# Altium schematic sheet Mosfet_and_Driver.SchDoc
size A4; Date: 22.07.2025; CheckedBy: Own Checked; CompanyName: No Company; DocumentNumber: ELK.PCB.0001.0001.A.A; Revision: V0.0.1; SheetNumber: 5; SheetTotal: 5
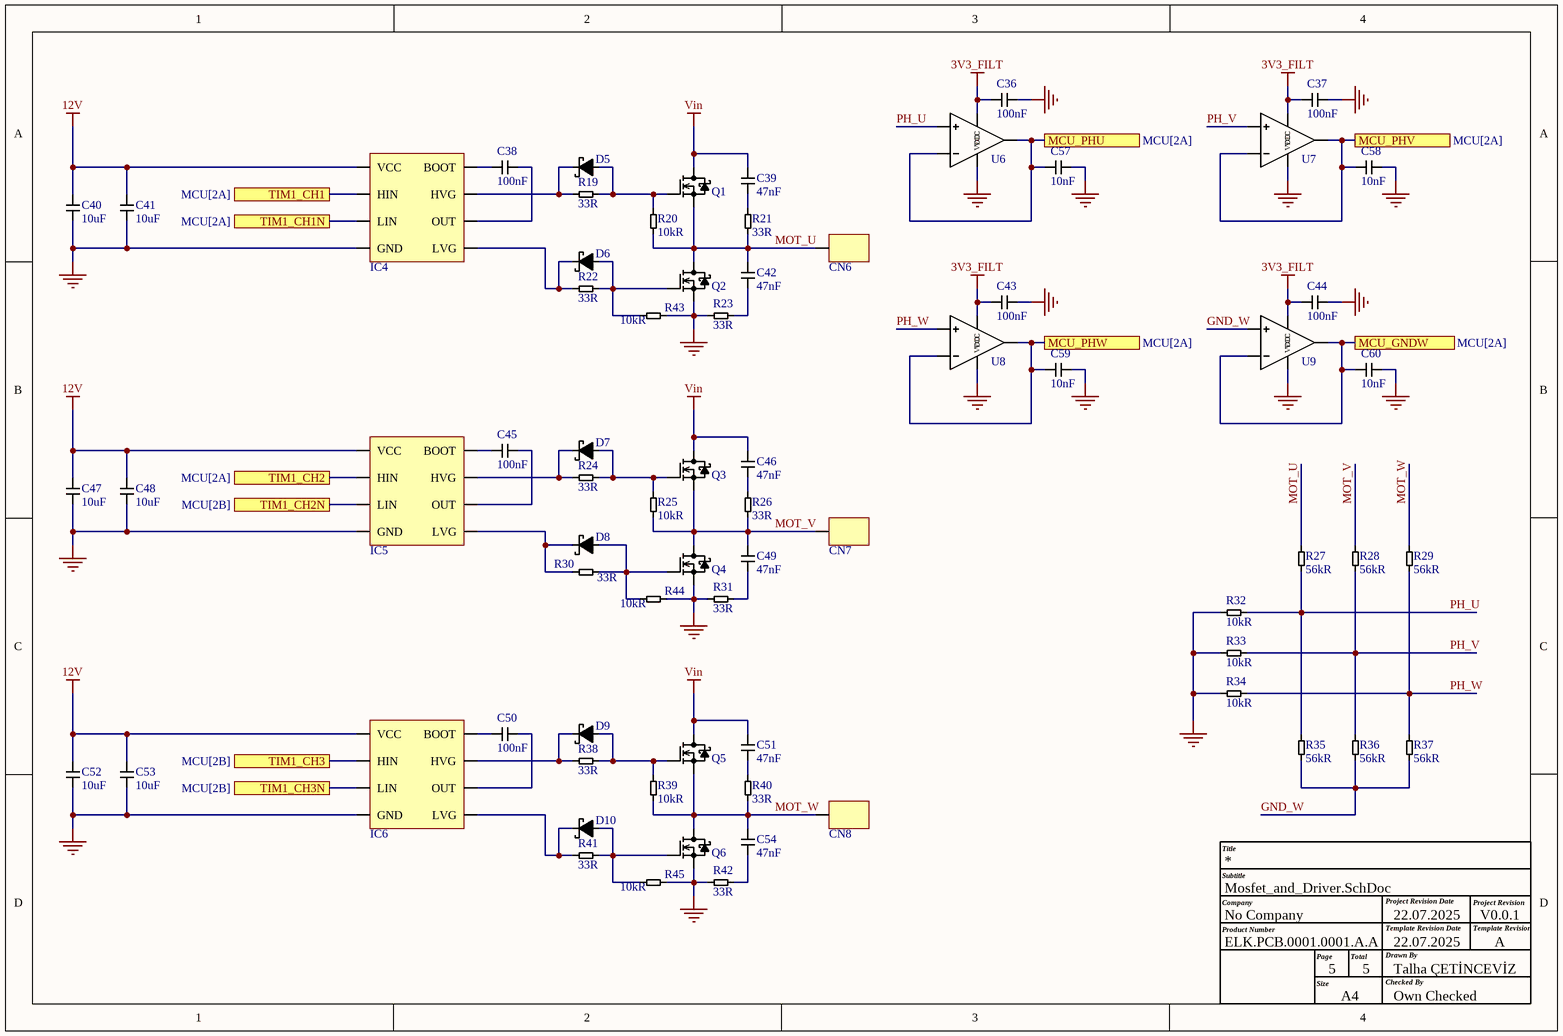
[diagram p0: Mosfet_and_Driver.SchDoc]

## Parts
C36  value 100nF  [CAP 0603]  (hidden comment: CC0603KRX7R9BB104)
C37  value 100nF  [CAP 0603]  (hidden comment: CC0603KRX7R9BB104)
C38  value 100nF  [CAP 0805]  (hidden comment: CL21B104KBCNNNC)
C39  value 47nF  [CAP 1206]  (hidden comment: CL31B473KBCNNNC)
C40  value 10uF  [CAP 0805]  (hidden comment: CL21A106KAYNNNE)
C41  value 10uF  [CAP 0805]  (hidden comment: CL21A106KAYNNNE)
C42  value 47nF  [CAP 1206]  (hidden comment: CL31B473KBCNNNC)
C43  value 100nF  [CAP 0603]  (hidden comment: CC0603KRX7R9BB104)
C44  value 100nF  [CAP 0603]  (hidden comment: CC0603KRX7R9BB104)
C45  value 100nF  [CAP 0805]  (hidden comment: CL21B104KBCNNNC)
C46  value 47nF  [CAP 1206]  (hidden comment: CL31B473KBCNNNC)
C47  value 10uF  [CAP 0805]  (hidden comment: CL21A106KAYNNNE)
C48  value 10uF  [CAP 0805]  (hidden comment: CL21A106KAYNNNE)
C49  value 47nF  [CAP 1206]  (hidden comment: CL31B473KBCNNNC)
C50  value 100nF  [CAP 0805]  (hidden comment: CL21B104KBCNNNC)
C51  value 47nF  [CAP 1206]  (hidden comment: CL31B473KBCNNNC)
C52  value 10uF  [CAP 0805]  (hidden comment: CL21A106KAYNNNE)
C53  value 10uF  [CAP 0805]  (hidden comment: CL21A106KAYNNNE)
C54  value 47nF  [CAP 1206]  (hidden comment: CL31B473KBCNNNC)
C57  value 10nF  [CAP 0603]  (hidden comment: CL10B103KB8NNNC)
C58  value 10nF  [CAP 0603]  (hidden comment: CL10B103KB8NNNC)
C59  value 10nF  [CAP 0603]  (hidden comment: CL10B103KB8NNNC)
C60  value 10nF  [CAP 0603]  (hidden comment: CL10B103KB8NNNC)
CN6  SMD PAD 1  [SMD PAD 1]  (value not drawn)  (no BOM)
CN7  SMD PAD 1  [SMD PAD 1]  (value not drawn)  (no BOM)
CN8  SMD PAD 1  [SMD PAD 1]  (value not drawn)  (no BOM)
D5  SS2060FL_R1_00001  [SOD123-FL]  (value not drawn)
D6  SS2060FL_R1_00001  [SOD123-FL]  (value not drawn)
D7  SS2060FL_R1_00001  [SOD123-FL]  (value not drawn)
D8  SS2060FL_R1_00001  [SOD123-FL]  (value not drawn)
D9  SS2060FL_R1_00001  [SOD123-FL]  (value not drawn)
D10  SS2060FL_R1_00001  [SOD123-FL]  (value not drawn)
IC4  L6388ED013TR  [SOIC-8]  (value not drawn)
IC5  L6388ED013TR  [SOIC-8]  (value not drawn)
IC6  L6388ED013TR  [SOIC-8]  (value not drawn)
Q1  P80FH5ENK-7071  [D2PAK-3]  (value not drawn)
Q2  P80FH5ENK-7071  [D2PAK-3]  (value not drawn)
Q3  P80FH5ENK-7071  [D2PAK-3]  (value not drawn)
Q4  P80FH5ENK-7071  [D2PAK-3]  (value not drawn)
Q5  P80FH5ENK-7071  [D2PAK-3]  (value not drawn)
Q6  P80FH5ENK-7071  [D2PAK-3]  (value not drawn)
R19  value 33R  [RES 0805]  (hidden comment: 0805S8F330JT5E)
R20  value 10kR  [RES 0603]  (hidden comment: RC0603FR-0710KL)
R21  value 33R  [RES 1206]  (hidden comment: CQ06S4F330JT5E)
R22  value 33R  [RES 0805]  (hidden comment: 0805S8F330JT5E)
R23  value 33R  [RES 1206]  (hidden comment: CQ06S4F330JT5E)
R24  value 33R  [RES 0805]  (hidden comment: 0805S8F330JT5E)
R25  value 10kR  [RES 0603]  (hidden comment: RC0603FR-0710KL)
R26  value 33R  [RES 1206]  (hidden comment: CQ06S4F330JT5E)
R27  value 56kR  [RES 0603]  (hidden comment: 0603SAF5602T5E)
R28  value 56kR  [RES 0603]  (hidden comment: 0603SAF5602T5E)
R29  value 56kR  [RES 0603]  (hidden comment: 0603SAF5602T5E)
R30  value 33R  [RES 0805]  (hidden comment: 0805S8F330JT5E)
R31  value 33R  [RES 1206]  (hidden comment: CQ06S4F330JT5E)
R32  value 10kR  [RES 0603]  (hidden comment: RC0603FR-0710KL)
R33  value 10kR  [RES 0603]  (hidden comment: RC0603FR-0710KL)
R34  value 10kR  [RES 0603]  (hidden comment: RC0603FR-0710KL)
R35  value 56kR  [RES 0603]  (hidden comment: 0603SAF5602T5E)
R36  value 56kR  [RES 0603]  (hidden comment: 0603SAF5602T5E)
R37  value 56kR  [RES 0603]  (hidden comment: 0603SAF5602T5E)
R38  value 33R  [RES 0805]  (hidden comment: 0805S8F330JT5E)
R39  value 10kR  [RES 0603]  (hidden comment: RC0603FR-0710KL)
R40  value 33R  [RES 1206]  (hidden comment: CQ06S4F330JT5E)
R41  value 33R  [RES 0805]  (hidden comment: 0805S8F330JT5E)
R42  value 33R  [RES 1206]  (hidden comment: CQ06S4F330JT5E)
R43  value 10kR  [RES 0603]  (hidden comment: RC0603FR-0710KL)
R44  value 10kR  [RES 0603]  (hidden comment: RC0603FR-0710KL)
R45  value 10kR  [RES 0603]  (hidden comment: RC0603FR-0710KL)
U6  LMV321ILT  [SOT23-5]  (value not drawn)
U7  LMV321ILT  [SOT23-5]  (value not drawn)
U8  LMV321ILT  [SOT23-5]  (value not drawn)
U9  LMV321ILT  [SOT23-5]  (value not drawn)

## Ports
MCU_GNDW (see MCU[2A]), MCU_PHU (see MCU[2A]), MCU_PHV (see MCU[2A]), MCU_PHW (see MCU[2A]), TIM1_CH1 (see MCU[2A]), TIM1_CH1N (see MCU[2A]), TIM1_CH2 (see MCU[2A]), TIM1_CH2N (see MCU[2B]), TIM1_CH3 (see MCU[2B]), TIM1_CH3N (see MCU[2B])

## Nets
3V3_FILT: C36.1 C37.1 C43.1 C44.1 U6.5(VCC) U7.5(VCC) U8.5(VCC) U9.5(VCC)
12V: C40.2 C41.2 C47.2 C48.2 C52.2 C53.2 IC4.3(VCC) IC5.3(VCC) IC6.3(VCC)
GND: C36.2 C37.2 C40.1 C41.1 C43.2 C44.2 C47.1 C48.1 C52.1 C53.1 C57.2 C58.2 C59.2 C60.2 IC4.4(GND) IC5.4(GND) IC6.4(GND) Q2.3(Source) Q4.3(Source) Q6.3(Source) R23.2 R31.2 R32.2 R33.2 R34.2 R42.2 R43.2 R44.2 R45.2 U6.2(VDD) U7.2(VDD) U8.2(VDD) U9.2(VDD)
Vin: C39.2 C46.2 C51.2 Q1.2(Drain) Q3.2(Drain) Q5.2(Drain)
GND_W: R35.1 R36.1 R37.1 U9.1(NON_Inverting_input)
MCU_GNDW: C60.1 U9.3(Inverting_Input) U9.4(Output) ; port MCU_GNDW
MCU_PHU: C57.1 U6.3(Inverting_Input) U6.4(Output) ; port MCU_PHU
MCU_PHV: C58.1 U7.3(Inverting_Input) U7.4(Output) ; port MCU_PHV
MCU_PHW: C59.1 U8.3(Inverting_Input) U8.4(Output) ; port MCU_PHW
MOT_U: C42.2 CN6.1 Q1.3(Source) Q2.2(Drain) R20.1 R21.1 R27.2
MOT_V: C49.2 CN7.1 Q3.3(Source) Q4.2(Drain) R25.1 R26.1 R28.2
MOT_W: C54.2 CN8.1 Q5.3(Source) Q6.2(Drain) R29.2 R39.1 R40.1
PH_U: R27.1 R32.1 R35.2 U6.1(NON_Inverting_input)
PH_V: R28.1 R33.1 R36.2 U7.1(NON_Inverting_input)
PH_W: R29.1 R34.1 R37.2 U8.1(NON_Inverting_input)
TIM1_CH1: IC4.2(HIN) ; port TIM1_CH1
TIM1_CH1N: IC4.1(LIN) ; port TIM1_CH1N
TIM1_CH2: IC5.2(HIN) ; port TIM1_CH2
TIM1_CH2N: IC5.1(LIN) ; port TIM1_CH2N
TIM1_CH3: IC6.2(HIN) ; port TIM1_CH3
TIM1_CH3N: IC6.1(LIN) ; port TIM1_CH3N
NetC38_1: C38.1 IC4.8(BOOT)
NetC38_2: C38.2 IC4.6(OUT)
NetC39_1: C39.1 R21.2
NetC42_1: C42.1 R23.1
NetC45_1: C45.1 IC5.8(BOOT)
NetC45_2: C45.2 IC5.6(OUT)
NetC46_1: C46.1 R26.2
NetC49_1: C49.1 R31.1
NetC50_1: C50.1 IC6.8(BOOT)
NetC50_2: C50.2 IC6.6(OUT)
NetC51_1: C51.1 R40.2
NetC54_1: C54.1 R42.1
NetD5_A: D5.A Q1.1(Gate) R19.2 R20.2
NetD5_C: D5.C IC4.7(HVG) R19.1
NetD6_A: D6.A Q2.1(Gate) R22.2 R43.1
NetD6_C: D6.C IC4.5(LVG) R22.1
NetD7_A: D7.A Q3.1(Gate) R24.2 R25.2
NetD7_C: D7.C IC5.7(HVG) R24.1
NetD8_A: D8.A Q4.1(Gate) R30.2 R44.1
NetD8_C: D8.C IC5.5(LVG) R30.1
NetD9_A: D9.A Q5.1(Gate) R38.2 R39.2
NetD9_C: D9.C IC6.7(HVG) R38.1
NetD10_A: D10.A Q6.1(Gate) R41.2 R45.1
NetD10_C: D10.C IC6.5(LVG) R41.1

## Notes on the sheet
- Title
- Company
- Product Number
- Subtitle
- Project Revision Date
- Template Revision Date
- Project Revision
- Template Revision
- Size
- Page
- A4
- Total
- Checked By
- Drawn By
- 22.07.2025
- Talha ÇETİNCEVİZ
- A

## Library data of the parts
C36 C37 C43 C44 = CC0603KRX7R9BB104: Multilayer Ceramic Capacitor, CC Series, 0.1 - F, - 10%, X7R, 50 V, 0603 [1608 Metric]; Manufacturer: Yageo; Dielectric Material: 4241ConductorMaterial; Voltage Rating: 50V; Supplier: Ozdisan; Supplier Part Number: CC0603KRX7R9BB104; Manufacturer Part Number: CC0603KRX7R9BB104; RoHS: Yes; Category: Ceramic Capacitors; Stock: 5600000; Pricing: 4000=0,0018, 20000=0,0017, 80000=0,0017, 200000=0,0016, 500000=0,0015 (USD); Mounting Technology: Surface Mount; Case/Package: 0603; Pins: 2; Case Code (Metric): 1608; Case Code (Imperial): 0603; Material: 4241ConductorMaterial; Min Operating Temperature: -55°C; Max Operating Temperature: 125°C; Tolerance: 10%; Dielectric: X7R; Termination: SMD/SMT; Voltage: 50V; Package Quantity: 1; Packaging: Tape and Reel; Series: CC; Length: 0.063inch; Width: 0.031inch; Height: 0.8mm; Thickness: 0.035inch; Depth: 0.8mm; Radiation Hardening: No; Reach SVHC Compliant: No; Lead Free: 5697LeadFree; Halogen Free: 5694HalogenFree; RoHS Compliant: Yes; ComponentLink1URL: https://datasheet.ciiva.com/11786/0900766b80d84f1d-11786061.pdf?src-supplier=Rs; ComponentLink1Description: https://datasheet.ciiva.com/11786/0900766b80d84f1d-11786061.pdf?src-supplier=Rs; ComponentLink2URL: https://datasheet.ciiva.com/8033/70765-8033821.pdf?src-supplier=Element14; ComponentLink2Description: https://datasheet.ciiva.com/8033/70765-8033821.pdf?src-supplier=Element14; ComponentLink3URL: https://datasheet.ciiva.com/7978/1489800-7978166.pdf?src-supplier=Element14; ComponentLink3Description: https://datasheet.ciiva.com/7978/1489800-7978166.pdf?src-supplier=Element14; ComponentLink4URL: https://datasheet.ciiva.com/144/mlccorderingcode-144177.pdf?src-supplier=Digikey; ComponentLink4Description: https://datasheet.ciiva.com/144/mlccorderingcode-144177.pdf?src-supplier=Digikey; ComponentLink5URL: https://datasheet.ciiva.com/144/mlccorderingcode-144176.pdf?src-supplier=Digikey; ComponentLink5Description: https://datasheet.ciiva.com/144/mlccorderingcode-144176.pdf?src-supplier=Digikey; ComponentLink6URL: https://datasheet.ciiva.com/144/mlccorderingcode-144178.pdf?src-supplier=Digikey; ComponentLink6Description: https://datasheet.ciiva.com/144/mlccorderingcode-144178.pdf?src-supplier=Digikey; ComponentLink7URL: https://datasheet.ciiva.com/8033/70765-8033819.pdf?src-supplier=Element14; ComponentLink7Description: https://datasheet.ciiva.com/8033/70765-8033819.pdf?src-supplier=Element14; ComponentLink8URL: https://datasheet.ciiva.com/31394/1489800-31394927.pdf?src-supplier=Farnell; ComponentLink8Description: https://datasheet.ciiva.com/31394/1489800-31394927.pdf?src-supplier=Farnell; ComponentLink9URL: https://datasheet.ciiva.com/22749/1489800-22749214.pdf?src-supplier=Element14; ComponentLink9Description: https://datasheet.ciiva.com/22749/1489800-22749214.pdf?src-supplier=Element14
C38 C45 C50 = CL21B104KBCNNNC: 50V 100nF X7R ±10% 0805 Multilayer Ceramic Capacitors MLCC - SMD/SMT ROHS; Manufacturer: Samsung; Supplier: Ozdisan; Supplier Part Number: CL21B104KBCNNNC; Manufacturer Part Number: CL21B104KBCNNNC; RoHS: Yes; Category: Ceramic Capacitors; Stock: 648000; Pricing: 4000=0,00539, 8000=0,00525, 16000=0,00508, 24000=0,0049, 32000=0,00473 (USD); Mounting Technology: Surface Mount; Case/Package: 0805; Case Code (Metric): 2012; Case Code (Imperial): 0805; Material: Ceramic; Min Operating Temperature: -55°C; Max Operating Temperature: 125°C; Tolerance: 10%; Dielectric: X7R; Packaging: Tape and Reel; Voltage Rating: 50V; Voltage: 50V; Series: CL; Construction: Flat; Voltage Rating (DC): 50V; Length: 2mm; Width: 0.049inch; Height: 0.85mm; Depth: 1.25mm; Thickness: 0.037inch; Radiation Hardening: No; RoHS Compliant: Yes; Lead Free: 5697LeadFree; ComponentLink1URL: https://datasheet.ciiva.com/25710/cl21b104kbcnnnc-25710182.pdf?src-supplier=Digikey; ComponentLink1Description: https://datasheet.ciiva.com/25710/cl21b104kbcnnnc-25710182.pdf?src-supplier=Digikey; ComponentLink2URL: https://datasheet.ciiva.com/29199/454152-da-01-en-vs-kondensator-0805-29199814.pdf?src-supplier=Conrad; ComponentLink2Description: https://datasheet.ciiva.com/29199/454152-da-01-en-vs-kondensator-0805-29199814.pdf?src-supplier=Conrad
C39 C42 C46 C49 C51 C54 = CL31B473KBCNNNC: MLCC (3216) 1206 47nF 50VDC ±10% X7R; Manufacturer: Samsung; Material: Ceramic; Tolerance: %10; Voltage Rating (DC): 50V; Supplier: Ozdisan; Supplier Part Number: CL31B473KBCNNNC; Manufacturer Part Number: CL31B473KBCNNNC; RoHS: Yes; Category: Ceramic Capacitors; Stock: 308000; Pricing: 16000=0,0114 (USD); ComponentLink1URL: https://datasheet.ciiva.com/15196/getdatasheetpartid-358694-15196056.pdf?src-supplier=Verical; ComponentLink1Description: https://datasheet.ciiva.com/15196/getdatasheetpartid-358694-15196056.pdf?src-supplier=Verical; ComponentLink2URL: https://datasheet.ciiva.com/29201/452141-da-01-en-vs-kondensator-1206-29201464.pdf?src-supplier=Conrad; ComponentLink2Description: https://datasheet.ciiva.com/29201/452141-da-01-en-vs-kondensator-1206-29201464.pdf?src-supplier=Conrad; ComponentLink3URL: https://datasheet.ciiva.com/16428/cl05b104kq5nnnc-16428956.pdf?src-supplier=Future+Electronics; ComponentLink3Description: https://datasheet.ciiva.com/16428/cl05b104kq5nnnc-16428956.pdf?src-supplier=Future+Electronics; Dielectric: X7R; Case/Package: 1206; Min Operating Temperature: -55°C; Max Operating Temperature: 125°C
C40 C41 C47 C48 C52 C53 = CL21A106KAYNNNE: 25V 10uF X5R ±10% 0805 Multilayer Ceramic Capacitors MLCC - SMD/SMT ROHS; Manufacturer: Samsung; Supplier: Ozdisan; Supplier Part Number: CL21A106KAYNNNE; Manufacturer Part Number: CL21A106KAYNNNE; RoHS: Yes; Category: Ceramic Capacitors; Stock: 3442000; Pricing: 2000=0,00823 (USD); Mounting Technology: Surface Mount; Case/Package: 0805; Case Code (Metric): 2012; Case Code (Imperial): 0805; Material: Ceramic; Min Operating Temperature: -55°C; Max Operating Temperature: 85°C; Package Quantity: 1; Packaging: Tape and Reel; Tolerance: 10%; Voltage Rating: 25V; Dielectric: X5R; Series: CL; Construction: Flat; Voltage Rating (DC): 25V; Length: 2mm; Width: 0.049inch; Height: 1.25mm; Thickness: 0.057inch; Depth: 1.25mm; Radiation Hardening: No; RoHS Compliant: Yes; ComponentLink1URL: https://datasheet.ciiva.com/25796/cl21a106kaynnne-25796720.pdf?src-supplier=Digikey; ComponentLink1Description: https://datasheet.ciiva.com/25796/cl21a106kaynnne-25796720.pdf?src-supplier=Digikey; ComponentLink2URL: https://datasheet.ciiva.com/26838/getdatasheetpartid-357558-26838583.pdf?src-supplier=Verical; ComponentLink2Description: https://datasheet.ciiva.com/26838/getdatasheetpartid-357558-26838583.pdf?src-supplier=Verical
C57-C60 = CL10B103KB8NNNC: 50V 10nF X7R ±10% 0603 Multilayer Ceramic Capacitors MLCC - SMD/SMT ROHS; Manufacturer: Samsung; Supplier: Ozdisan; Supplier Part Number: CL10B103KB8NNNC; Manufacturer Part Number: CL10B103KB8NNNC; RoHS: Yes; Category: Ceramic Capacitors; Stock: 2448000; Pricing: 4000=0,00299, 8000=0,00291, 16000=0,00281, 24000=0,00272, 32000=0,00262 (USD); Mounting Technology: Surface Mount; Case/Package: 0603; Case Code (Metric): 1608; Case Code (Imperial): 0603; Material: Ceramic; Min Operating Temperature: -55°C; Max Operating Temperature: 125°C; Tolerance: 10%; Dielectric: X7R; Voltage: 50V; Voltage Rating (DC): 50V; Voltage Rating: 50V; Package Quantity: 1; Packaging: Tape and Reel; Series: CL; Construction: Flat; Length: 1.6mm; Width: 0.031inch; Height: 0.8mm; Depth: 0.8mm; Thickness: 0.035inch; Radiation Hardening: No; Lead Free: 5697LeadFree; RoHS Compliant: Yes; ComponentLink1URL: https://datasheet.ciiva.com/15195/getdatasheetpartid-357415-15195721.pdf?src-supplier=Verical; ComponentLink1Description: https://datasheet.ciiva.com/15195/getdatasheetpartid-357415-15195721.pdf?src-supplier=Verical; ComponentLink2URL: https://datasheet.ciiva.com/29198/457455-da-01-en-vs-kondensator-0603-29198644.pdf?src-supplier=Conrad; ComponentLink2Description: https://datasheet.ciiva.com/29198/457455-da-01-en-vs-kondensator-0603-29198644.pdf?src-supplier=Conrad
D5-D10 = SS2060FL_R1_00001: Schottky-diode 2A 60V SOD123FL; Manufacturer: Pan Jit; Max Reverse Current: 500uA; Peak Non-Repetitive Surge Current: 50A; Supplier: Ozdisan; Supplier Part Number: SS2060FL_R1_00001; Manufacturer Part Number: SS2060FL_R1_00001; RoHS: Yes; Category: Rectifier Diodes; Stock: 6399; Pricing: 1=0,36, 10=0,232, 50=0,232, 100=0,161, 1000=0,107, 10000=0,067 (USD); Mounting Technology: Surface Mount; Pins: 2; Min Operating Temperature: -50°C; Max Operating Temperature: 125°C; Max Repetitive Reverse Voltage (Vrrm): 60V; RoHS Compliant: Yes; ComponentLink1URL: http://www.panjit.com/upload/product/5/SS2020FL_SERIES.pdf?src-supplier=Avnet; ComponentLink1Description: http://www.panjit.com/upload/product/5/SS2020FL_SERIES.pdf?src-supplier=Avnet
IC4-IC6 = L6388ED013TR: L6388E Series 17 V 650 mA High Voltage High and Low-Side Driver - SOIC-8; Manufacturer: STMicroelectronics; Number of Channels: 2NUMBER; Value: 125R; Output Voltage: 580V; Undervoltage Threshold: 8.3V; Supplier: Ozdisan; Supplier Part Number: L6388ED013TR; Manufacturer Part Number: L6388ED013TR; RoHS: Yes; Category: Gate Drivers; Stock: 37500; Pricing: 2500=0,87, 5000=0,86, 7500=0,85 (USD); Lead Free: 5697LeadFree; ComponentLink1URL: https://datasheet.ciiva.com/1950/cd00049626-1950093.pdf?src-supplier=Digikey; ComponentLink1Description: https://datasheet.ciiva.com/1950/cd00049626-1950093.pdf?src-supplier=Digikey; ComponentLink2URL: https://datasheet.ciiva.com/1950/cd00049626-1950092.pdf?src-supplier=Digikey; ComponentLink2Description: https://datasheet.ciiva.com/1950/cd00049626-1950092.pdf?src-supplier=Digikey; ComponentLink3URL: https://datasheet.ciiva.com/1950/cd00049626-1950094.pdf?src-supplier=Digikey; ComponentLink3Description: https://datasheet.ciiva.com/1950/cd00049626-1950094.pdf?src-supplier=Digikey; ComponentLink4URL: https://datasheet.ciiva.com/41457/001185561-da-01-en-ic-driver-hi-lo-l6388ed013tr-soic-8-stm-41457639.pdf?src-supplier=Conrad; ComponentLink4Description: https://datasheet.ciiva.com/41457/001185561-da-01-en-ic-driver-hi-lo-l6388ed013tr-soic-8-stm-41457639.pdf?src-supplier=Conrad; Case/Package: SOIC-8; Min Operating Temperature: -40°C; Max Operating Temperature: 125°C
Q1-Q6 = P80FH5ENK-7071: MOSFET POWER 80A 50V N-CH TO263AB; Manufacturer: SHINDENGEN; Rds On: 3mR; Trr: 47nS; Power Dissipation: 128W; Supplier: Ozdisan; Supplier Part Number: P80FH5ENK-7071; Manufacturer Part Number: P80FH5ENK-7071; Case/Package: TO263-3 (D2PAK-3); RoHS: RoHS; Min Operating Temperature: -55°C; Max Operating Temperature: 150°C; Current (25°C): 80A
R19 R22 R24 R30 R38 R41 = 0805S8F330JT5E: Res General Purpose Thick Film 0805 33 Ohm 1% 1/8W ±200ppm/°C Molded T/R; Manufacturer: Multicomp; Manufacturer Part Number: MC0805S8F330JT5E; Power Rating: 125mW; Voltage Rating: 150V; Temperature Coefficient: 100ppm/°C; Supplier: Ozdisan; Supplier Part Number: 0805S8F330JT5E; RoHS: Yes; Category: Resistors; Stock: 1106; Pricing: 5000=0,029 (EUR); Case/Package: 0805; Pins: 2; Case Code (Metric): 2012; Case Code (Imperial): 0805; Resistor Type: Thick Film; Packaging: Cut Tape; Voltage Rating (DC): 150V; Resistance Tolerance: 1%; Series: MC; Reach SVHC Compliant: Unknown; ComponentLink1URL: http://www.newark.com/pdfs/datasheets/spc/TA-677.pdf?src-supplier=Farnell; ComponentLink1Description: http://www.newark.com/pdfs/datasheets/spc/TA-677.pdf?src-supplier=Farnell; ComponentLink2URL: https://datasheet.octopart.com/MC0805S8F330JT5E-Multicomp-datasheet-14877041.pdf?src-supplier=Element14; ComponentLink2Description: https://datasheet.octopart.com/MC0805S8F330JT5E-Multicomp-datasheet-14877041.pdf?src-supplier=Element14
R20 R25 R32-R34 R39 R43-R45 = RC0603FR-0710KL: SMD Chip Resistor, 10 Kohm, ½ 1%, 100 Mw, 0603 [1608 Metric], Thick Film, General Purpose; Manufacturer: Yageo; Voltage Rating (DC): 50V; Temperature Coefficient: 100ppm/°C; Voltage Rating: 75V; Power Rating: 100mW; Supplier: Ozdisan; Supplier Part Number: RC0603FR-0710KL; Manufacturer Part Number: RC0603FR-0710KL; RoHS: Yes; Category: Chip SMD Resistors; Stock: 42525000; Pricing: 5000=0,001, 25000=0,001, 150000=0,001, 500000=0,0009, 1500000=0,0009 (USD); Case/Package: 0603; Pins: 2; Case Code (Imperial): 0603; Case Code (Metric): 1608; Weight: 7.1E-05oz; Min Operating Temperature: -55°C; Max Operating Temperature: 155°C; Packaging: Tape and Reel; Tolerance: 1%; Termination: SMD/SMT; Resistor Type: Thick Film; Features: Moisture Resistant; Series: RC; Max Power Dissipation: 100mW; Number of Terminations: 2; Resistance Tolerance: 1%; Construction: Rectangular; Length: 1.6mm; Width: 0.8mm; Height: 0.45mm; Depth: 0.8mm; Lead Pitch: 0.3mm; Reach SVHC Compliant: No; Lead Free: 5697LeadFree; Military Standard: Not; RoHS Compliant: Yes; ComponentLink1URL: https://datasheet.ciiva.com/7660/38590-7660789.pdf?src-supplier=Element14; ComponentLink1Description: https://datasheet.ciiva.com/7660/38590-7660789.pdf?src-supplier=Element14; ComponentLink2URL: https://datasheet.ciiva.com/7983/443971-7983596.pdf?src-supplier=Element14; ComponentLink2Description: https://datasheet.ciiva.com/7983/443971-7983596.pdf?src-supplier=Element14; ComponentLink3URL: https://datasheet.ciiva.com/22747/443971-22747519.pdf?src-supplier=Element14; ComponentLink3Description: https://datasheet.ciiva.com/22747/443971-22747519.pdf?src-supplier=Element14; ComponentLink4URL: https://datasheet.ciiva.com/46440/1868787-46440891.pdf?src-supplier=Element14; ComponentLink4Description: https://datasheet.ciiva.com/46440/1868787-46440891.pdf?src-supplier=Element14; ComponentLink5URL: https://datasheet.ciiva.com/7746/1738695-7746239.pdf?src-supplier=Element14; ComponentLink5Description: https://datasheet.ciiva.com/7746/1738695-7746239.pdf?src-supplier=Element14; ComponentLink6URL: https://datasheet.ciiva.com/15189/getdatasheetpartid-409289-15189591.pdf?src-supplier=Verical; ComponentLink6Description: https://datasheet.ciiva.com/15189/getdatasheetpartid-409289-15189591.pdf?src-supplier=Verical
R21 R23 R26 R31 R40 R42 = CQ06S4F330JT5E: RES.(3216) 1206 33 Ohms 1% 1/4W-S AUTOMOTIV; Manufacturer: Royal Electronic Factory; Voltage Rating (DC): 200V; Temperature Coefficient: 100 PPM; Power Rating: 250mW; Resistance Tolerance: %1; Supplier: Ozdisan; Supplier Part Number: CQ06S4F330JT5E; Manufacturer Part Number: CQ06S4F330JT5E; RoHS: No; Pricing: 10000=0,004 (USD); Min Operating Temperature: -55°C; Max Operating Temperature: 155°C; Case/Package: 1206; Category: Resistors
R27-R29 R35-R37 = 0603SAF5602T5E: Res Thick Film 0603 56K Ohm 1% 0.1W(1/10W) ±100ppm/C Pad SMD T/R; Manufacturer: Royal Electronic Factory; Temperature Coefficient: 100ppm/°C; Voltage Rating (DC): 100mW; Resistance Tolerance: %1; Supplier: Ozdisan; Supplier Part Number: 0603SAF5602T5E; Manufacturer Part Number: 0603SAF5602T5E; RoHS: No; Stock: 5000; Pricing: 10000=0,001 (USD); ComponentLink1URL: https://datasheet.octopart.com/0603SAF5602T5E-Royal-Ohm-datasheet-165785611.pdf?src-supplier=TME; ComponentLink1Description: https://datasheet.octopart.com/0603SAF5602T5E-Royal-Ohm-datasheet-165785611.pdf?src-supplier=TME; Min Operating Temperature: -55°C; Max Operating Temperature: 155°C; Case/Package: 0603
U6-U9 = LMV321ILT: LMV321 Series 6 V 1 MHz Low Power Rail to Rail Operational Amplifier - SOT-23-5; Manufacturer: STMicroelectronics; Supplier: Ozdisan; Supplier Part Number: LMV321ILT; Manufacturer Part Number: LMV321ILT; RoHS: Yes; Category: Amplifiers - Op Amps, Buffer, Instrumentation; Stock: 405000; Pricing: 3000=0,0711, 9000=0,0694, 15000=0,0686, 45000=0,0669, 75000=0,0654 (USD); Lead Free: 5697LeadFree; ComponentLink1URL: https://datasheet.ciiva.com/41459/001185379-da-01-en-ic-op-amp-sgl-r-r-lmv321ilt-sot-23-5-stm-41459833.pdf?src-supplier=Conrad; ComponentLink1Description: https://datasheet.ciiva.com/41459/001185379-da-01-en-ic-op-amp-sgl-r-r-lmv321ilt-sot-23-5-stm-41459833.pdf?src-supplier=Conrad; ComponentLink2URL: https://datasheet.ciiva.com/16449/cd00079372-16449002.pdf?src-supplier=Future+Electronics; ComponentLink2Description: https://datasheet.ciiva.com/16449/cd00079372-16449002.pdf?src-supplier=Future+Electronics; ComponentLink3URL: https://datasheet.ciiva.com/1795/cd00079372-1795891.pdf?src-supplier=Digikey; ComponentLink3Description: https://datasheet.ciiva.com/1795/cd00079372-1795891.pdf?src-supplier=Digikey; ComponentLink4URL: https://datasheet.ciiva.com/1795/cd00079372-1795892.pdf?src-supplier=Digikey; ComponentLink4Description: https://datasheet.ciiva.com/1795/cd00079372-1795892.pdf?src-supplier=Digikey; ComponentLink5URL: https://datasheet.ciiva.com/1795/cd00079372-1795893.pdf?src-supplier=Digikey; ComponentLink5Description: https://datasheet.ciiva.com/1795/cd00079372-1795893.pdf?src-supplier=Digikey; ComponentLink6URL: https://datasheet.ciiva.com/11710/cd00079372-11710214.pdf?src-supplier=Avnet; ComponentLink6Description: https://datasheet.ciiva.com/11710/cd00079372-11710214.pdf?src-supplier=Avnet; ComponentLink7URL: https://datasheet.ciiva.com/8008/1733540-8008505.pdf?src-supplier=Element14; ComponentLink7Description: https://datasheet.ciiva.com/8008/1733540-8008505.pdf?src-supplier=Element14; ComponentLink8URL: https://datasheet.ciiva.com/8008/1733540-8008506.pdf?src-supplier=Element14; ComponentLink8Description: https://datasheet.ciiva.com/8008/1733540-8008506.pdf?src-supplier=Element14; Case/Package: SOT23-5; Min Operating Temperature: -40°C; Max Operating Temperature: 125°C